# Altium schematic sheet Sensors.SchDoc
size A4; SheetNumber: 2; SheetTotal: 4
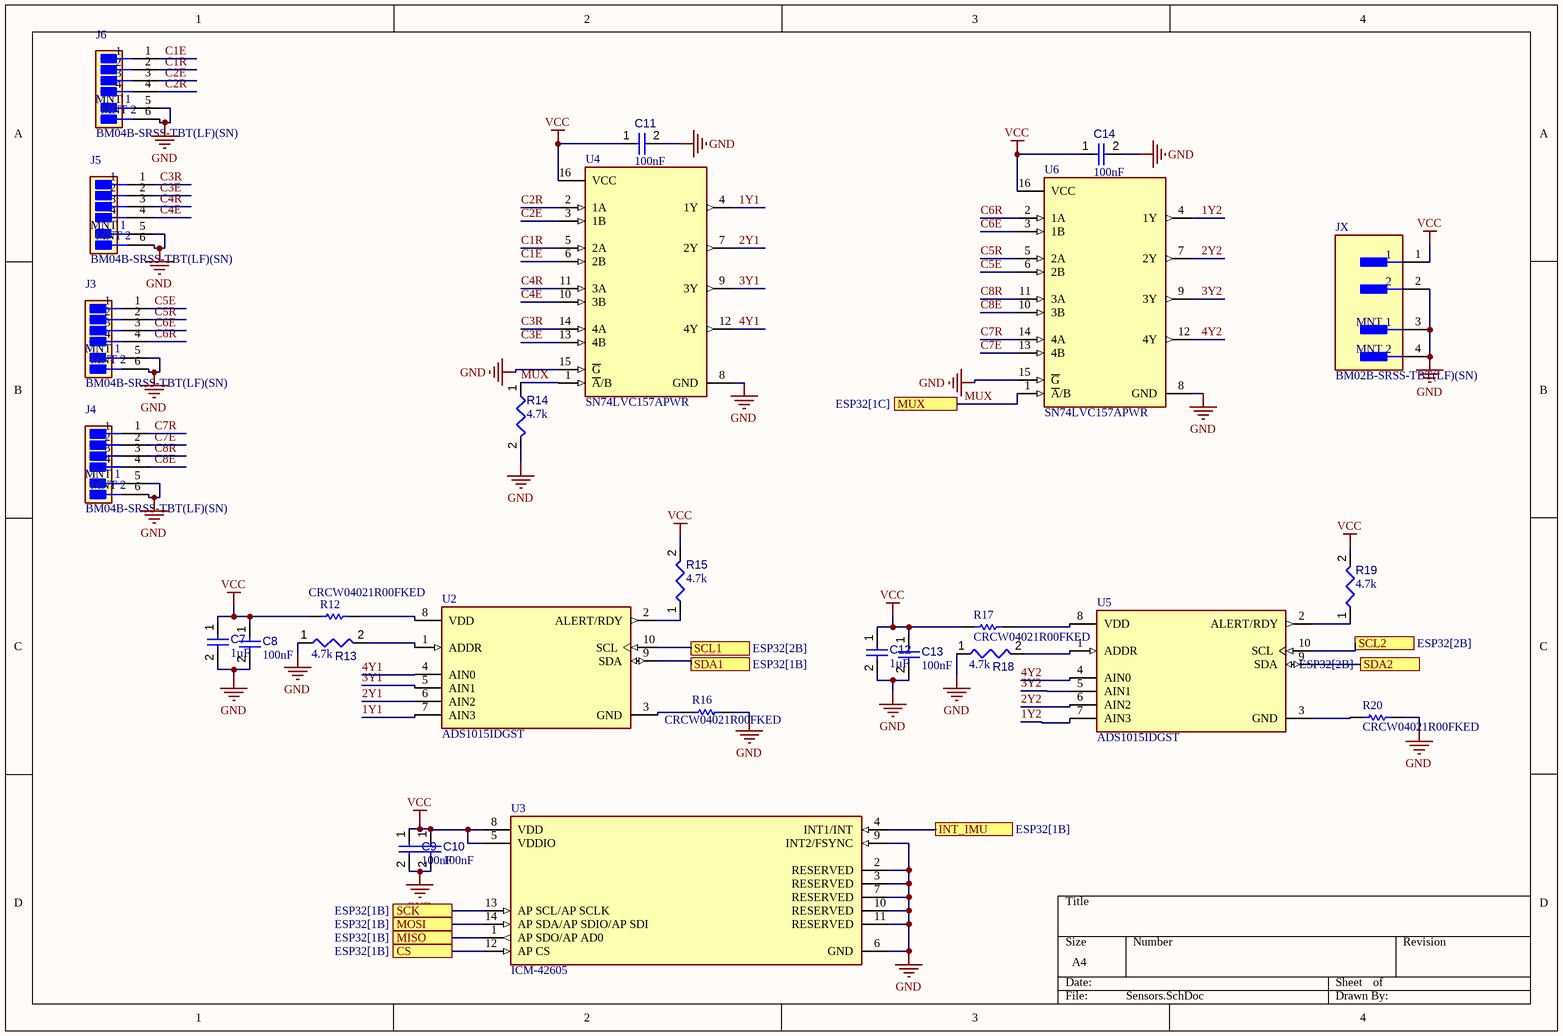
[diagram p0: Sensors.SchDoc]

## Parts
C7  value 1µF  [CAPC1005X55X25LL05T10]  (hidden comment: Capacitor 1 uF +/- 10% 6.3 V 0402)
C8  value 100nF  [CAPC1005X56X25LL10T15]  (hidden comment: Capacitor 0.1 uF +/- 5% 16 V 0402)
C9  value 100nF  [CAPC1005X56X25LL10T15]  (hidden comment: Capacitor 0.1 uF +/- 5% 16 V 0402)
C10  value 100nF  [CAPC1005X56X25LL10T15]  (hidden comment: Capacitor 0.1 uF +/- 5% 16 V 0402)
C11  value 100nF  [CAPC1005X56X25LL10T15]  (hidden comment: Capacitor 0.1 uF +/- 5% 16 V 0402)
C12  value 1µF  [CAPC1005X55X25LL05T10]  (hidden comment: Capacitor 1 uF +/- 10% 6.3 V 0402)
C13  value 100nF  [CAPC1005X56X25LL10T15]  (hidden comment: Capacitor 0.1 uF +/- 5% 16 V 0402)
C14  value 100nF  [CAPC1005X56X25LL10T15]  (hidden comment: Capacitor 0.1 uF +/- 5% 16 V 0402)
J3  BM04B-SRSS-TBT(LF)(SN)  [FP-BM04B-SRSS-TBT_LF_SN-MFG]
J4  BM04B-SRSS-TBT(LF)(SN)  [FP-BM04B-SRSS-TBT_LF_SN-MFG]
J5  BM04B-SRSS-TBT(LF)(SN)  [FP-BM04B-SRSS-TBT_LF_SN-MFG]
J6  BM04B-SRSS-TBT(LF)(SN)  [FP-BM04B-SRSS-TBT_LF_SN-MFG]
JX  BM02B-SRSS-TBT(LF)(SN)  [FP-BM02B-SRSS-TBT_LF_SN-MFG]
R12  CRCW04021R00FKED  [RESC1005X40X25ML05T05]
R13  value 4.7k  [RESC1005X40X25ML05T05]  (hidden comment: Resistor 4k7 +/-1% 0402 100 mW)
R14  value 4.7k  [RESC1005X40X25ML05T05]  (hidden comment: Resistor 4k7 +/-1% 0402 100 mW)
R15  value 4.7k  [RESC1005X40X25ML05T05]  (hidden comment: Resistor 4k7 +/-1% 0402 100 mW)
R16  CRCW04021R00FKED  [RESC1005X40X25ML05T05]
R17  CRCW04021R00FKED  [RESC1005X40X25ML05T05]
R18  value 4.7k  [RESC1005X40X25ML05T05]  (hidden comment: Resistor 4k7 +/-1% 0402 100 mW)
R19  value 4.7k  [RESC1005X40X25ML05T05]  (hidden comment: Resistor 4k7 +/-1% 0402 100 mW)
R20  CRCW04021R00FKED  [RESC1005X40X25ML05T05]
U2  ADS1015IDGST  [FP-DGS0010A-MFG]
U3  ICM-42605  [FP-ICM-42605-MFG]
U4  SN74LVC157APWR  [FP-PW0016A-IPC_B]
U5  ADS1015IDGST  [FP-DGS0010A-MFG]
U6  SN74LVC157APWR  [FP-PW0016A-IPC_B]

## Ports
CS (see ESP32[1B]), INT_IMU (see ESP32[1B]), MISO (see ESP32[1B]), MOSI (see ESP32[1B]), MUX (see ESP32[1C]), SCK (see ESP32[1B]), SCL1 (see ESP32[2B]), SCL2 (see ESP32[2B]), SDA1 (see ESP32[1B]), SDA2 (see ESP32[2B])

## Nets
GND: C7.2 C8.2 C9.2 C10.2 C11.2 C12.2 C13.2 C14.2 J3.5(MNT_1) J3.6(MNT_2) J4.5(MNT_1) J4.6(MNT_2) J5.5(MNT_1) J5.6(MNT_2) J6.5(MNT_1) J6.6(MNT_2) JX.2 JX.3(MNT_1) JX.4(MNT_2) R13.1 R14.2 R16.2 R18.1 R20.2 U3.2(RESERVED) U3.3(RESERVED) U3.6(GND) U3.7(RESERVED) U3.9(INT2/FSYNC) U3.10(RESERVED) U3.11(RESERVED) U4.8(GND) U4.15(~{G}) U6.8(GND) U6.15(~{G})
VCC: C7.1 C8.1 C9.1 C10.1 C11.1 C12.1 C13.1 C14.1 JX.1 R12.1 R15.2 R17.1 R19.2 U3.5(VDDIO) U3.8(VDD) U4.16(VCC) U6.16(VCC)
1Y1: U2.7(AIN3) U4.4(1Y)
1Y2: U5.7(AIN3) U6.4(1Y)
2Y1: U2.6(AIN2) U4.7(2Y)
2Y2: U5.6(AIN2) U6.7(2Y)
3Y1: U2.5(AIN1) U4.9(3Y)
3Y2: U5.5(AIN1) U6.9(3Y)
4Y1: U2.4(AIN0) U4.12(4Y)
4Y2: U5.4(AIN0) U6.12(4Y)
C1E: J6.1 U4.6(2B)
C1R: J6.2 U4.5(2A)
C2E: J6.3 U4.3(1B)
C2R: J6.4 U4.2(1A)
C3E: J5.2 U4.13(4B)
C3R: J5.1 U4.14(4A)
C4E: J5.4 U4.10(3B)
C4R: J5.3 U4.11(3A)
C5E: J3.1 U6.6(2B)
C5R: J3.2 U6.5(2A)
C6E: J3.3 U6.3(1B)
C6R: J3.4 U6.2(1A)
C7E: J4.2 U6.13(4B)
C7R: J4.1 U6.14(4A)
C8E: J4.4 U6.10(3B)
C8R: J4.3 U6.11(3A)
CS: U3.12(AP_CS) ; port CS
INT_IMU: U3.4(INT1/INT) ; port INT_IMU
MISO: U3.1(AP_SDO/AP_AD0) ; port MISO
MOSI: U3.14(AP_SDA/AP_SDIO/AP_SDI) ; port MOSI
MUX: R14.1 U4.1(~{A}/B) U6.1(~{A}/B) ; port MUX
SCK: U3.13(AP_SCL/AP_SCLK) ; port SCK
SCL1: U2.10(SCL) ; port SCL1
SCL2: U5.10(SCL) ; port SCL2
SDA1: U2.9(SDA) ; port SDA1
SDA2: U5.9(SDA) ; port SDA2
NetR12_2: R12.2 U2.8(VDD)
NetR13_2: R13.2 U2.1(ADDR)
NetR15_1: R15.1 U2.2(ALERT/RDY)
NetR16_1: R16.1 U2.3(GND)
NetR17_2: R17.2 U5.8(VDD)
NetR18_2: R18.2 U5.1(ADDR)
NetR19_1: R19.1 U5.2(ALERT/RDY)
NetR20_1: R20.1 U5.3(GND)

## Library data of the parts
C7 C12 = CMP-001-00008-6: Chip Capacitor, 1 uF, +/- 10%, 6.3 V, 0402 (1005 Metric); Capacitor Type: Ceramic; Voltage Rating: 6.3V; Max Operating Temperature: 85°C; Mounting Technology: SM; Tolerance: 10%; Case/Package: 0402; RoHS Compliant: True; Min Operating Temperature: -55°C; Pins: 2
C8-C11 C13 C14 = CMP-001-00001-6: Chip Capacitor, 0.1 uF, +/- 5%, 16 V, 0402 (1005 Metric); Capacitor Type: Ceramic; Voltage Rating: 16V; Max Operating Temperature: 125°C; Min Operating Temperature: -55°C; Case/Package: 0402; Mounting Technology: SM; Pins: 2; Tolerance: 5%; RoHS Compliant: True
J3-J6 = CMP-00030-00003-2: 1.0mm Pitch, Ultra-Compact, Low Profile Design, Interchangeable Shrouded Header
JX = CMP-17439-000179-1: CONN WIRE HDR 2POS 1MM STSMD; Mated Stacking Heights: 4.9mm; Max Current Rating: 1A; Pitch: 0.039inch; Contact Resistance: 20mR; Max Voltage Rating (DC): 50V; Connector Type: Header; Number of Positions: 2; Insulation Material: Nylon; Termination: Solder; Contact Plating: Tin; Mount: Surface Mount; Package Quantity: 1500; Housing Color: Natural; Orientation: Straight; Max Operating Temperature: 85°C; Min Operating Temperature: -25°C; Length: 4mm; Lead Free: Lead Free; Contact Type: Male Pin; Depth: 3.6mm; Contact Material: Copper Alloy; Packaging: Tape and Reel; Number of Rows: 1; Contact Shape: Square; Flammability Rating: UL94 V-0; Voltage Rating: 50V; Color: Natural; Contact Finish - Mating: TIN; Fastening Type: Pull; Insulation Color: Natural; Series: SR; Max Voltage Rating (AC): 50V; Housing Material: Polyamide
R12 R16 R17 R20 = CMP-2002-08342-1: Manufacturer: Vishay Dale; Part Number: CRCW04021R00FKED
R13-R15 R18 R19 = CMP-009-00030-5: Chip Resistor, 4.7 KOhm, +/- 1%, 0.1 W, -55 to 155 degC, 0402 (1005 Metric); Power: 100mW; Voltage Rating: 50V; Mounting Technology: SM; RoHS Compliant: True; Tolerance: 1%; Min Operating Temperature: -55°C; Max Operating Temperature: 155°C; Case/Package: 0402; Pins: 2
U2 U5 = CMP-0003-00377-3: IC ADC 12BIT SIGMA-DELTA 10VSSOP; Supply Type: Single; Number of Converters: 1; Number of Bits: 12; Number of Inputs: 4; Sampling Rate: 3.3KS/s; Conversion Rate: 3300S/s; Min Supply Voltage: 2V; Interface: I2C; Operating Supply Voltage: 3.3V; Polarity: Bipolar; Nominal Supply Current: 150uA; Integral Nonlinearity (INL): 0.5LSB; Max Power Dissipation: 900uW; Max Supply Voltage (DC): 5.5V; Resolution: 12b; Width: 3mm; Min Operating Temperature: -40°C; Contact Plating: Gold; Number of A/D Converters: 1; Max Operating Temperature: 125°C; Height: 1.02mm; Case/Package: VSSOP; Package Quantity: 250; Number of Elements: 1; Lead Free: Lead Free; Number of Pins: 10; Radiation Hardening: No; Termination: SMD/SMT; Length: 3mm; Min Supply Voltage (DC): 2V; Power Dissipation: 900uW; Number of Channels: 4; Max Supply Voltage: 5.5V; REACH SVHC: No SVHC; Packaging: Tape and Reel
U3 = ICM-42605-1: Open-drain, CMOS, 14 Pin
U4 U6 = CMP-031-00008-1: Multiplexer, LVC/LCX/Z Series, 4-Func, 2 Line Input, 1 Line Output, True Output, CMOS, PDSO16; Min Supply Voltage: 1.65V; Max Supply Voltage: 3.6V; Min Operating Temperature: -40°C; RoHS Compliant: Yes; Pins: 16; Max Operating Temperature: 85°C; Case/Package: TSSOP